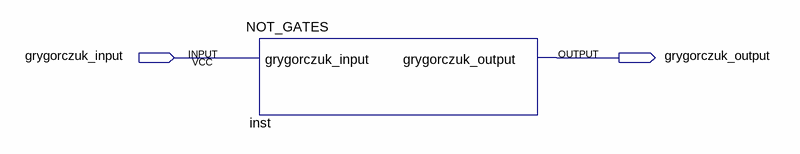
[diagram p0: schematic sheet]
// Quartus schematic NOT_SYMBOL.bdf as structural Verilog: 1 symbols, 2 pins
module NOT_SYMBOL (
  input  grygorczuk_input,
  output grygorczuk_output
);

  NOT_GATES inst (.grygorczuk_input(grygorczuk_input), .grygorczuk_output(grygorczuk_output));
endmodule
